# EAGLE design ProbeStationRelayBoard (EAGLE 9.6.2)
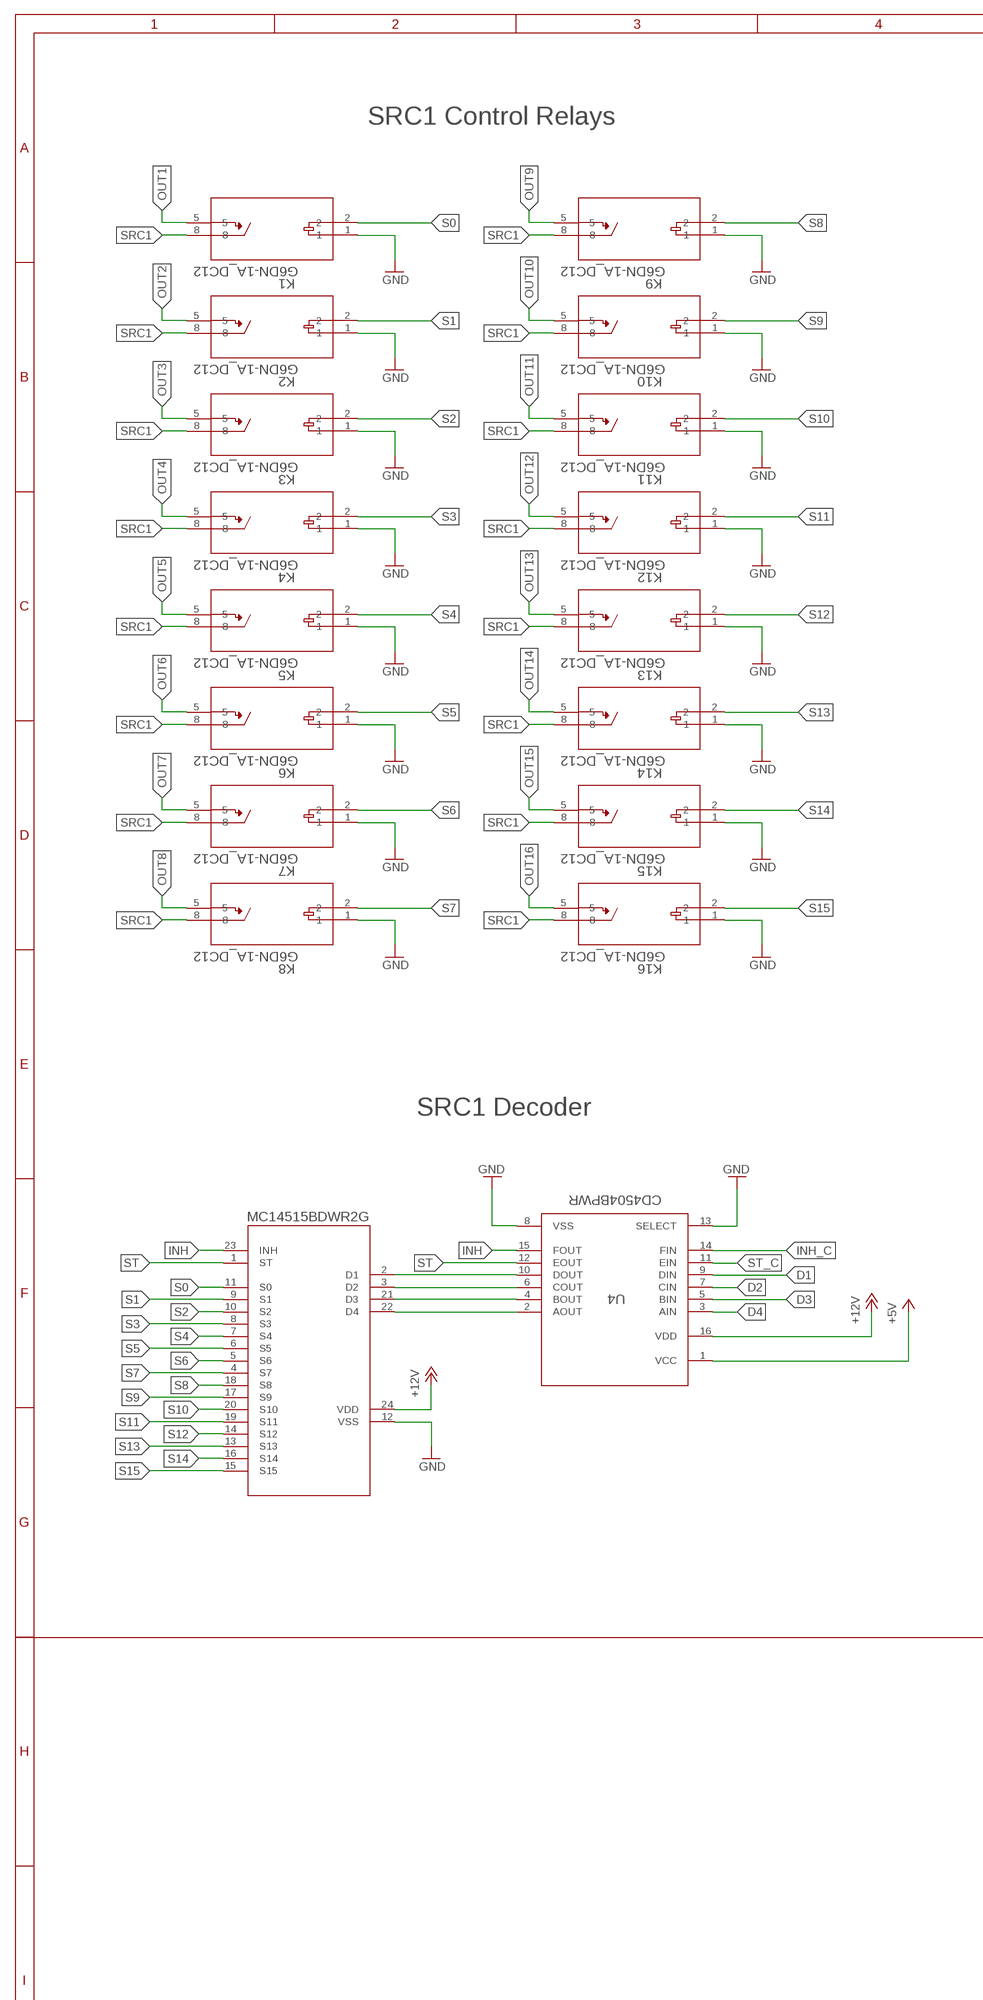
[diagram p0: schematic, sheet 1, part 1 of 2]
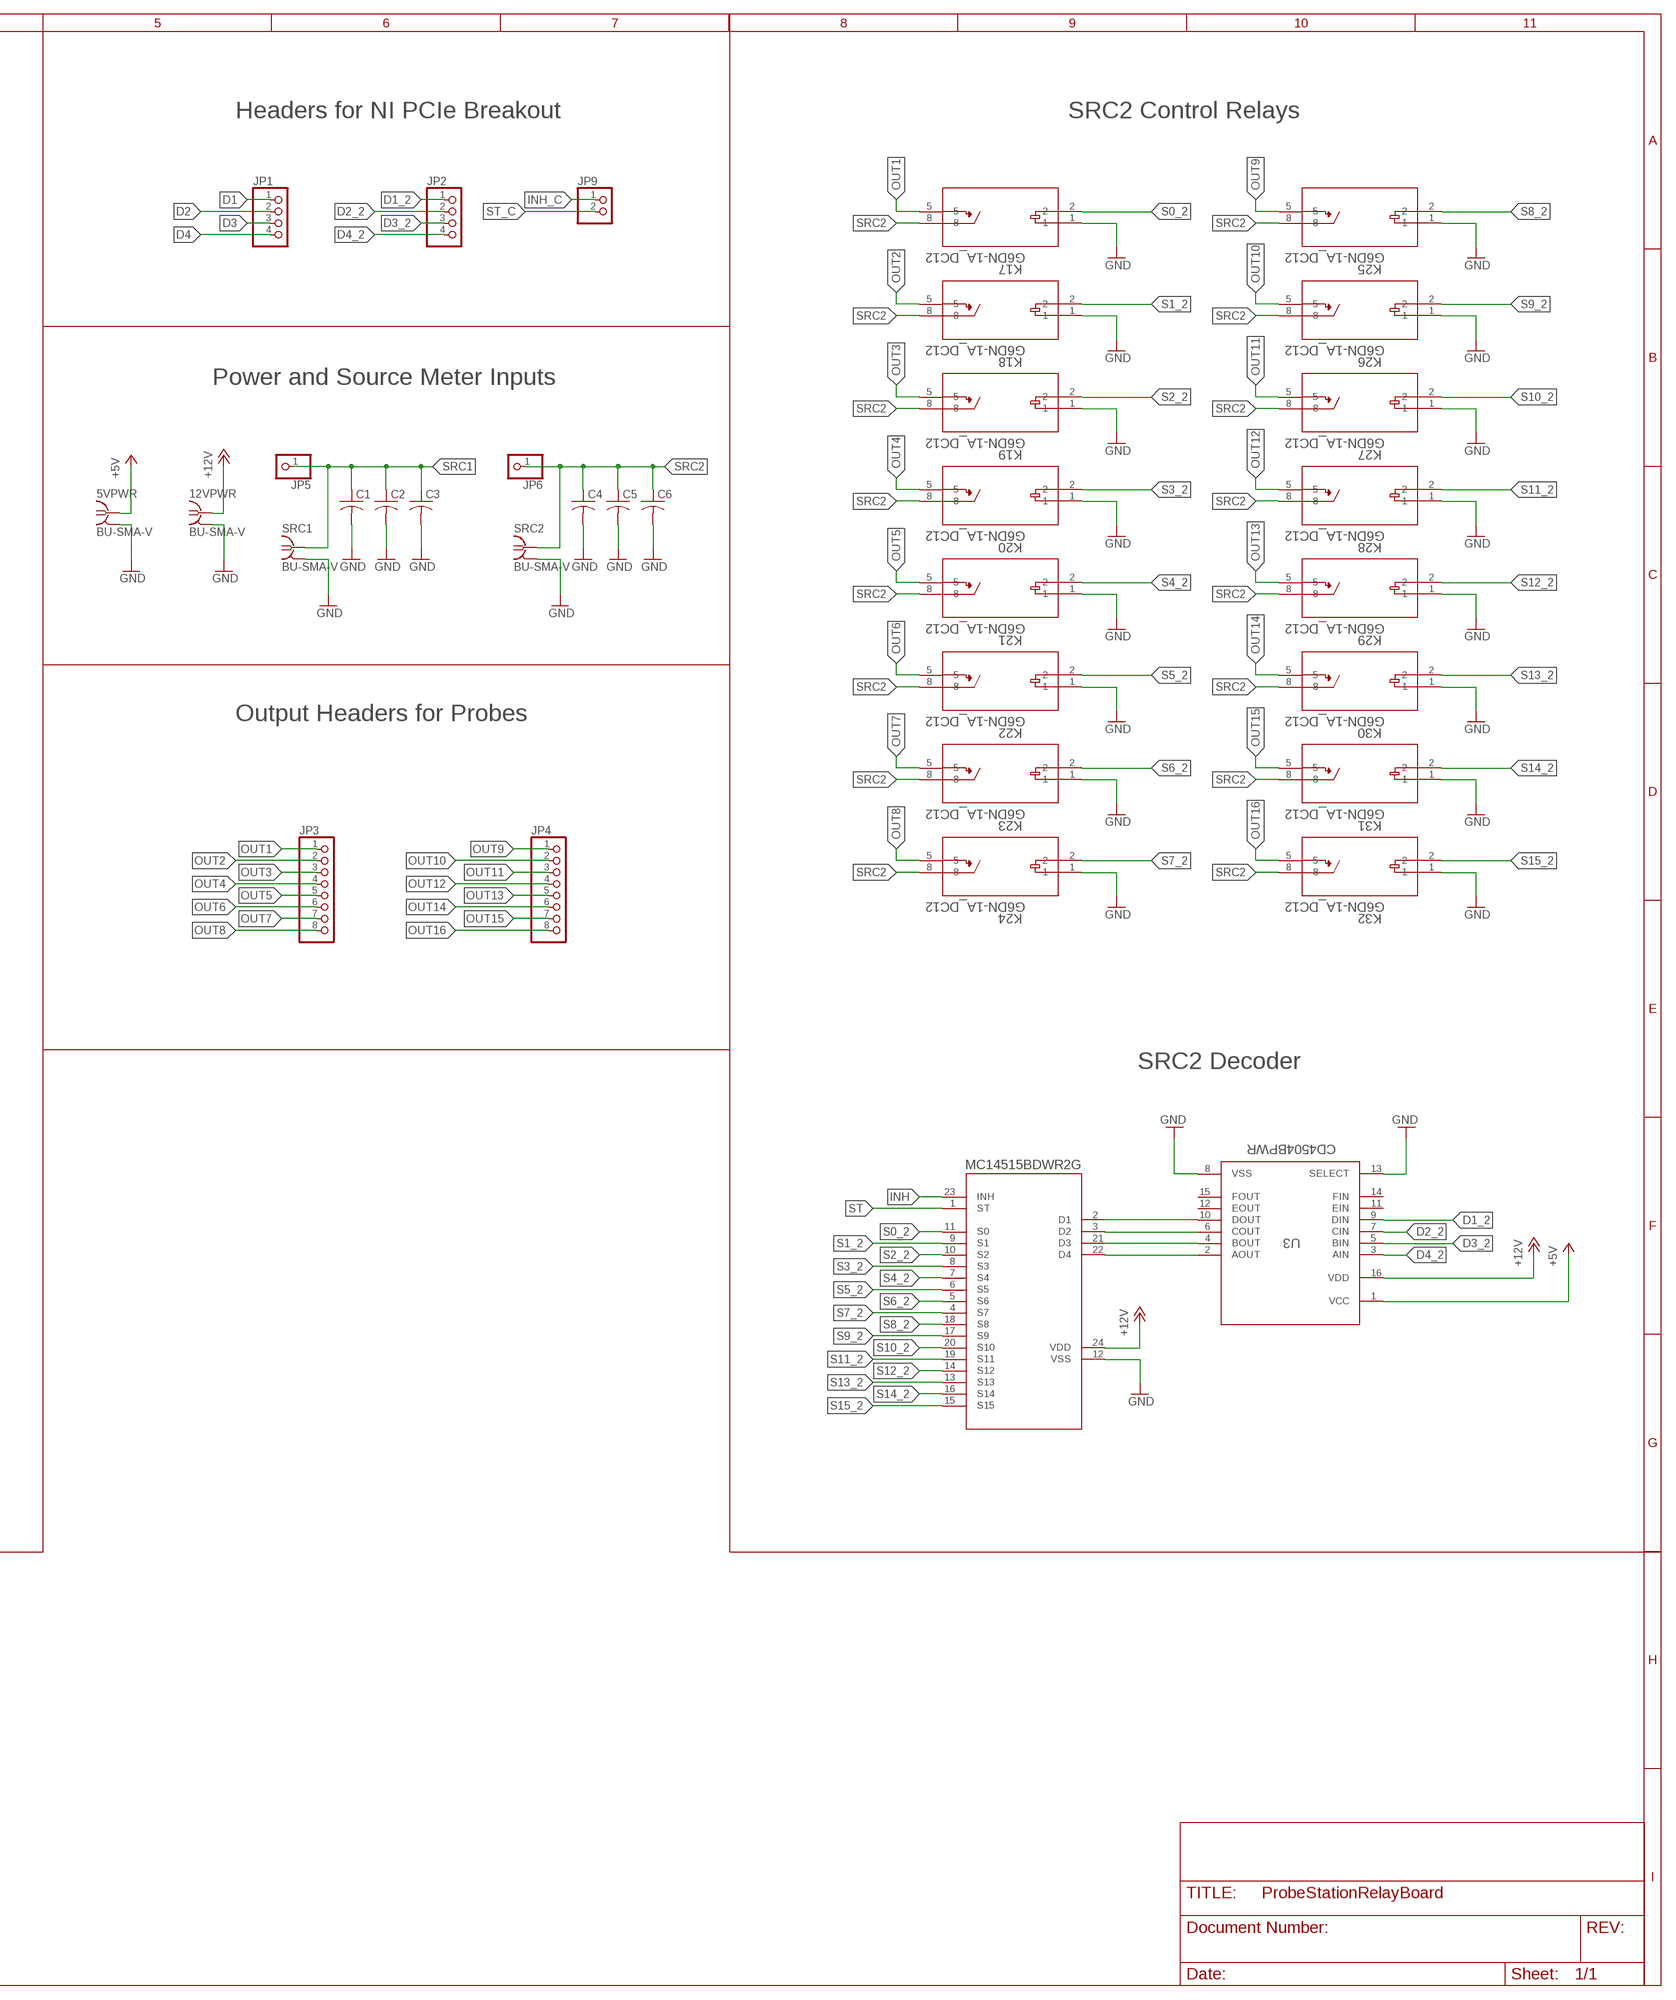
[diagram p1: schematic, sheet 1, part 2 of 2]

## Parts
5VPWR  BU-SMA-V  [BU-SMA-V]
12VPWR  BU-SMA-V  [BU-SMA-V]
C1  C-USC0805  [C0805]
C2  C-USC0805  [C0805]
C3  C-USC0805  [C0805]
C4  C-USC0805  [C0805]
C5  C-USC0805  [C0805]
C6  C-USC0805  [C0805]
JP1  PINHD-1X4  [1X04]
JP2  PINHD-1X4  [1X04]
JP3  PINHD-1X8  [1X08]
JP4  PINHD-1X8  [1X08]
JP5  PINHD-1X1  [1X01]
JP6  PINHD-1X1  [1X01]
JP9  PINHD-1X2  [1X02]
K1  G6DN-1A_DC12  [RELAY_G6DN-1A_OMR]
K2  G6DN-1A_DC12  [RELAY_G6DN-1A_OMR]
K3  G6DN-1A_DC12  [RELAY_G6DN-1A_OMR]
K4  G6DN-1A_DC12  [RELAY_G6DN-1A_OMR]
K5  G6DN-1A_DC12  [RELAY_G6DN-1A_OMR]
K6  G6DN-1A_DC12  [RELAY_G6DN-1A_OMR]
K7  G6DN-1A_DC12  [RELAY_G6DN-1A_OMR]
K8  G6DN-1A_DC12  [RELAY_G6DN-1A_OMR]
K9  G6DN-1A_DC12  [RELAY_G6DN-1A_OMR]
K10  G6DN-1A_DC12  [RELAY_G6DN-1A_OMR]
K11  G6DN-1A_DC12  [RELAY_G6DN-1A_OMR]
K12  G6DN-1A_DC12  [RELAY_G6DN-1A_OMR]
K13  G6DN-1A_DC12  [RELAY_G6DN-1A_OMR]
K14  G6DN-1A_DC12  [RELAY_G6DN-1A_OMR]
K15  G6DN-1A_DC12  [RELAY_G6DN-1A_OMR]
K16  G6DN-1A_DC12  [RELAY_G6DN-1A_OMR]
K17  G6DN-1A_DC12  [RELAY_G6DN-1A_OMR]
K18  G6DN-1A_DC12  [RELAY_G6DN-1A_OMR]
K19  G6DN-1A_DC12  [RELAY_G6DN-1A_OMR]
K20  G6DN-1A_DC12  [RELAY_G6DN-1A_OMR]
K21  G6DN-1A_DC12  [RELAY_G6DN-1A_OMR]
K22  G6DN-1A_DC12  [RELAY_G6DN-1A_OMR]
K23  G6DN-1A_DC12  [RELAY_G6DN-1A_OMR]
K24  G6DN-1A_DC12  [RELAY_G6DN-1A_OMR]
K25  G6DN-1A_DC12  [RELAY_G6DN-1A_OMR]
K26  G6DN-1A_DC12  [RELAY_G6DN-1A_OMR]
K27  G6DN-1A_DC12  [RELAY_G6DN-1A_OMR]
K28  G6DN-1A_DC12  [RELAY_G6DN-1A_OMR]
K29  G6DN-1A_DC12  [RELAY_G6DN-1A_OMR]
K30  G6DN-1A_DC12  [RELAY_G6DN-1A_OMR]
K31  G6DN-1A_DC12  [RELAY_G6DN-1A_OMR]
K32  G6DN-1A_DC12  [RELAY_G6DN-1A_OMR]
SRC1  BU-SMA-V  [BU-SMA-V]
SRC2  BU-SMA-V  [BU-SMA-V]
U1  MC14515BDWR2G  [SOIC-24WB_ONS]
U2  MC14515BDWR2G  [SOIC-24WB_ONS]
U3  CD4504BPWR  [PW0016A_N]
U4  CD4504BPWR  [PW0016A_N]

## Nets
+5V: 5VPWR.1 U3.1(VCC) U4.1(VCC)
+12V: 12VPWR.1 U1.24(VDD) U2.24(VDD) U3.16(VDD) U4.16(VDD)
D1: JP1.1 U4.9(DIN)
D1_2: JP2.1 U3.9(DIN)
D2: JP1.2 U4.7(CIN)
D2_2: JP2.2 U3.7(CIN)
D3: JP1.3 U4.5(BIN)
D3_2: JP2.3 U3.5(BIN)
D4: JP1.4 U4.3(AIN)
D4_2: JP2.4 U3.3(AIN)
GND: 5VPWR.2 5VPWR.3 5VPWR.4 5VPWR.5 12VPWR.2 12VPWR.3 12VPWR.4 12VPWR.5 C1.2 C2.2 C3.2 C4.2 C5.2 C6.2 K1.1 K2.1 K3.1 K4.1 K5.1 K6.1 K7.1 K8.1 K9.1 K10.1 K11.1 K12.1 K13.1 K14.1 K15.1 K16.1 K17.1 K18.1 K19.1 K20.1 K21.1 K22.1 K23.1 K24.1 K25.1 K26.1 K27.1 K28.1 K29.1 K30.1 K31.1 K32.1 SRC1.2 SRC1.3 SRC1.4 SRC1.5 SRC2.2 SRC2.3 SRC2.4 SRC2.5 U1.12(VSS) U2.12(VSS) U3.8(VSS) U3.13(SELECT) U4.8(VSS) U4.13(SELECT)
INH: U1.23(INH) U2.23(INH) U4.15(FOUT)
INH_C: JP9.1 U4.14(FIN)
N$1: U2.22(D4) U4.2(AOUT)
N$2: U2.21(D3) U4.4(BOUT)
N$3: U2.3(D2) U4.6(COUT)
N$4: U2.2(D1) U4.10(DOUT)
N$5: U1.22(D4) U3.2(AOUT)
N$6: U1.21(D3) U3.4(BOUT)
N$7: U1.3(D2) U3.6(COUT)
N$8: U1.2(D1) U3.10(DOUT)
OUT1: JP3.1 K1.5 K17.5
OUT2: JP3.2 K2.5 K18.5
OUT3: JP3.3 K3.5 K19.5
OUT4: JP3.4 K4.5 K20.5
OUT5: JP3.5 K5.5 K21.5
OUT6: JP3.6 K6.5 K22.5
OUT7: JP3.7 K7.5 K23.5
OUT8: JP3.8 K8.5 K24.5
OUT9: JP4.1 K9.5 K25.5
OUT10: JP4.2 K10.5 K26.5
OUT11: JP4.3 K11.5 K27.5
OUT12: JP4.4 K12.5 K28.5
OUT13: JP4.5 K13.5 K29.5
OUT14: JP4.6 K14.5 K30.5
OUT15: JP4.7 K15.5 K31.5
OUT16: JP4.8 K16.5 K32.5
S0: K1.2 U2.11(S0)
S0_2: K17.2 U1.11(S0)
S1: K2.2 U2.9(S1)
S1_2: K18.2 U1.9(S1)
S2: K3.2 U2.10(S2)
S2_2: K19.2 U1.10(S2)
S3: K4.2 U2.8(S3)
S3_2: K20.2 U1.8(S3)
S4: K5.2 U2.7(S4)
S4_2: K21.2 U1.7(S4)
S5: K6.2 U2.6(S5)
S5_2: K22.2 U1.6(S5)
S6: K7.2 U2.5(S6)
S6_2: K23.2 U1.5(S6)
S7: K8.2 U2.4(S7)
S7_2: K24.2 U1.4(S7)
S8: K9.2 U2.18(S8)
S8_2: K25.2 U1.18(S8)
S9: K10.2 U2.17(S9)
S9_2: K26.2 U1.17(S9)
S10: K11.2 U2.20(S10)
S10_2: K27.2 U1.20(S10)
S11: K12.2 U2.19(S11)
S11_2: K28.2 U1.19(S11)
S12: K13.2 U2.14(S12)
S12_2: K29.2 U1.14(S12)
S13: K14.2 U2.13(S13)
S13_2: K30.2 U1.13(S13)
S14: K15.2 U2.16(S14)
S14_2: K31.2 U1.16(S14)
S15: K16.2 U2.15(S15)
S15_2: K32.2 U1.15(S15)
SRC1: C1.1 C2.1 C3.1 JP5.1 K1.8 K2.8 K3.8 K4.8 K5.8 K6.8 K7.8 K8.8 K9.8 K10.8 K11.8 K12.8 K13.8 K14.8 K15.8 K16.8 SRC1.1
SRC2: C4.1 C5.1 C6.1 JP6.1 K17.8 K18.8 K19.8 K20.8 K21.8 K22.8 K23.8 K24.8 K25.8 K26.8 K27.8 K28.8 K29.8 K30.8 K31.8 K32.8 SRC2.1
ST: U1.1(ST) U2.1(ST) U4.12(EOUT)
ST_C: JP9.2 U4.11(EIN)
Unconnected: U3.11(EIN) U3.12(EOUT) U3.14(FIN) U3.15(FOUT)

## Notes on the sheet
- SRC1 Control Relays | Headers for NI PCIe Breakout | SRC2 Control Relays
- Power and Source Meter Inputs
- Output Headers for Probes
- SRC1 Decoder
- SRC2 Decoder

## Library data of the parts
5VPWR 12VPWR SRC1 SRC2 = con-coax:BU-SMA-V: FEMALE SMA CONNECTOR Radiall distributor RS 112-3794; OC_FARNELL: unknown; OC_NEWARK: unknown
C1-C6 = rcl:C-US: CAPACITOR, American symbol; SPICEPREFIX: C
JP1 JP2 = pinhead:PINHD-1X4: PIN HEADER
JP3 JP4 = pinhead:PINHD-1X8: PIN HEADER
JP5 JP6 = pinhead:PINHD-1X1: PIN HEADER
JP9 = pinhead:PINHD-1X2: PIN HEADER
K1-K32 = RELAY_G6DN_DC12:G6DN-1A_DC12; COPYRIGHT: Copyright (C) 2021 Ultra Librarian. All rights reserved.; DIGI-KEY_PART_NUMBER_1: Z5440-ND; MANUFACTURER_PART_NUMBER: G6DN-1A DC12; MFR_NAME: Omron
U1 U2 = MC14515BDWR2G:MC14515BDWR2G; COPYRIGHT: Copyright (C) 2021 Ultra Librarian. All rights reserved.; DIGI-KEY_PART_NUMBER_1: 2156-MC14515BDWR2G-OS-ND; DIGI-KEY_PART_NUMBER_2: MC14515BDWR2G-ND; DIGI-KEY_PART_NUMBER_3: MC14515BDWR2GOSCT-ND; DIGI-KEY_PART_NUMBER_4: MC14515BDWR2GOSDKR-ND; DIGI-KEY_PART_NUMBER_5: MC14515BDWR2GOSTR-ND; MANUFACTURER_PART_NUMBER: MC14515BDWR2G; MFR_NAME: ON Semiconductor
U3 U4 = CD4504BPWR:CD4504BPWR; COPYRIGHT: Copyright (C) 2021 Ultra Librarian. All rights reserved.; DIGI-KEY_PART_NUMBER_1: 296-12010-1-ND; DIGI-KEY_PART_NUMBER_2: 296-12010-2-ND; DIGI-KEY_PART_NUMBER_3: 296-12010-6-ND; MANUFACTURER_PART_NUMBER: CD4504BPWR; MFR_NAME: Texas Instruments; REFDES: RefDes; TYPE: TYPE

## Board
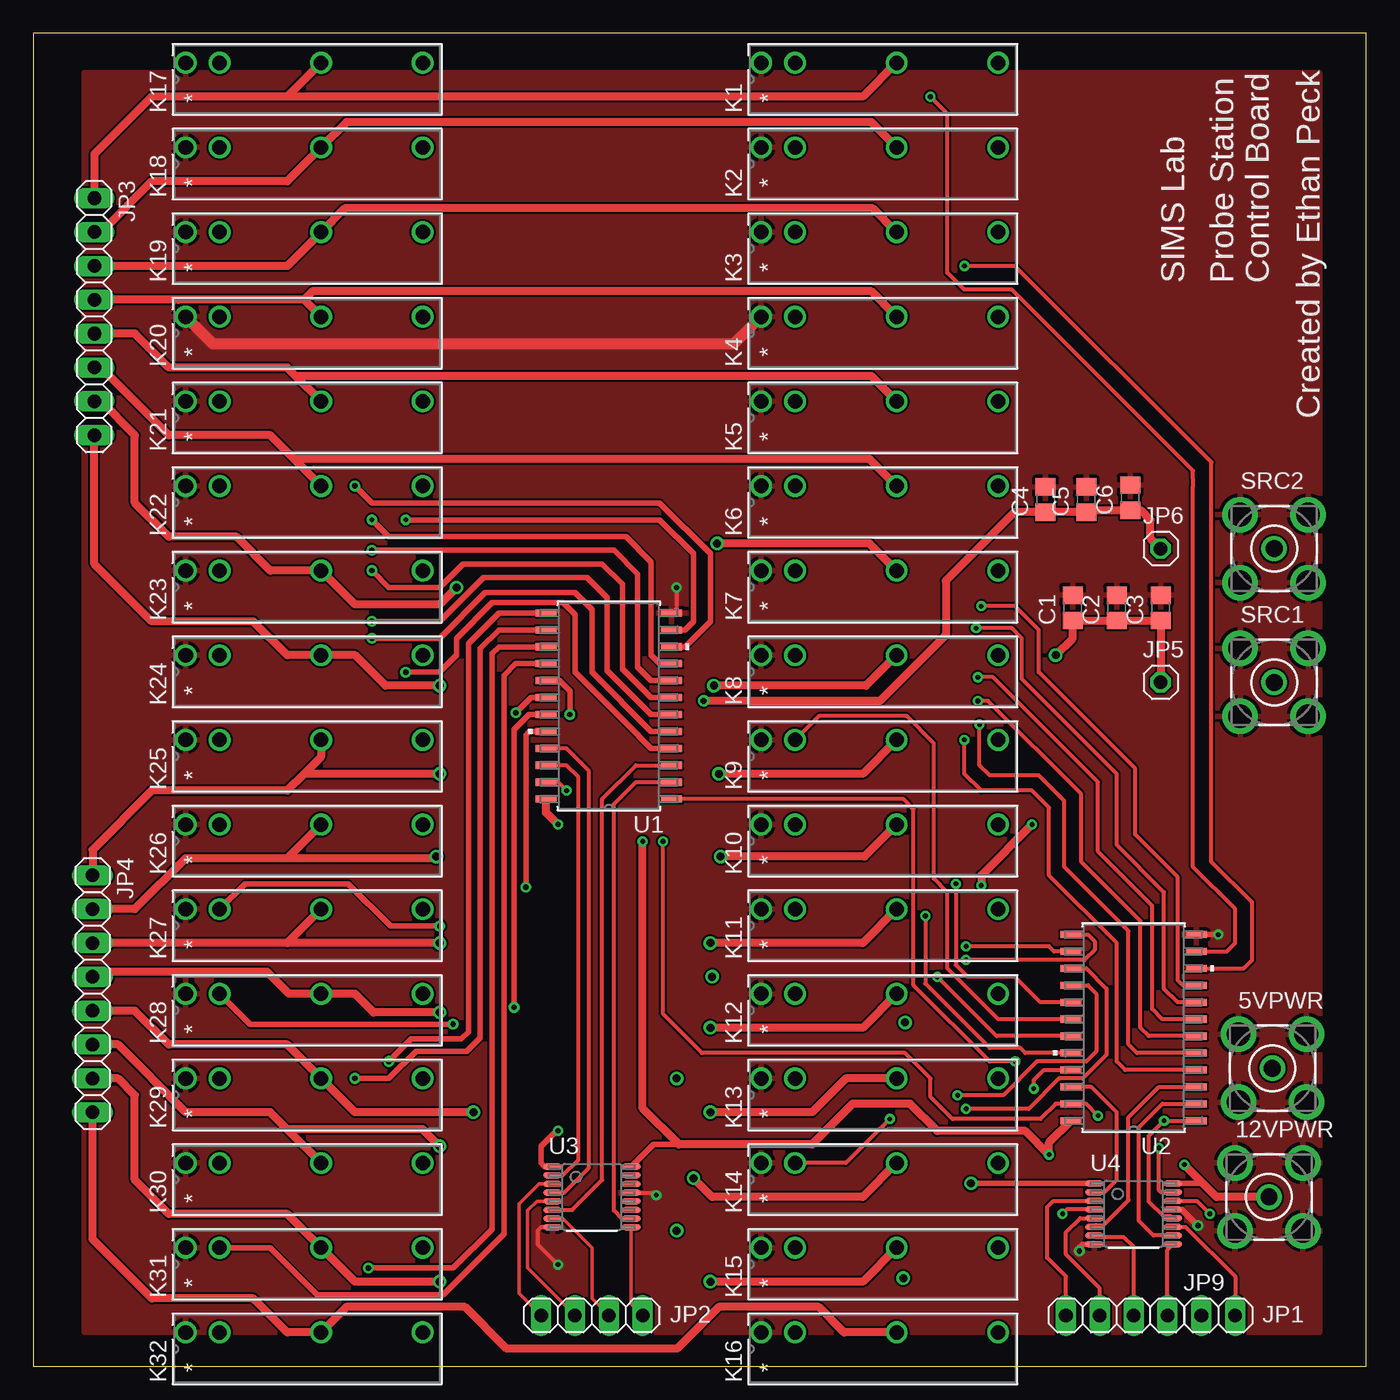
[diagram p2: board, top side]
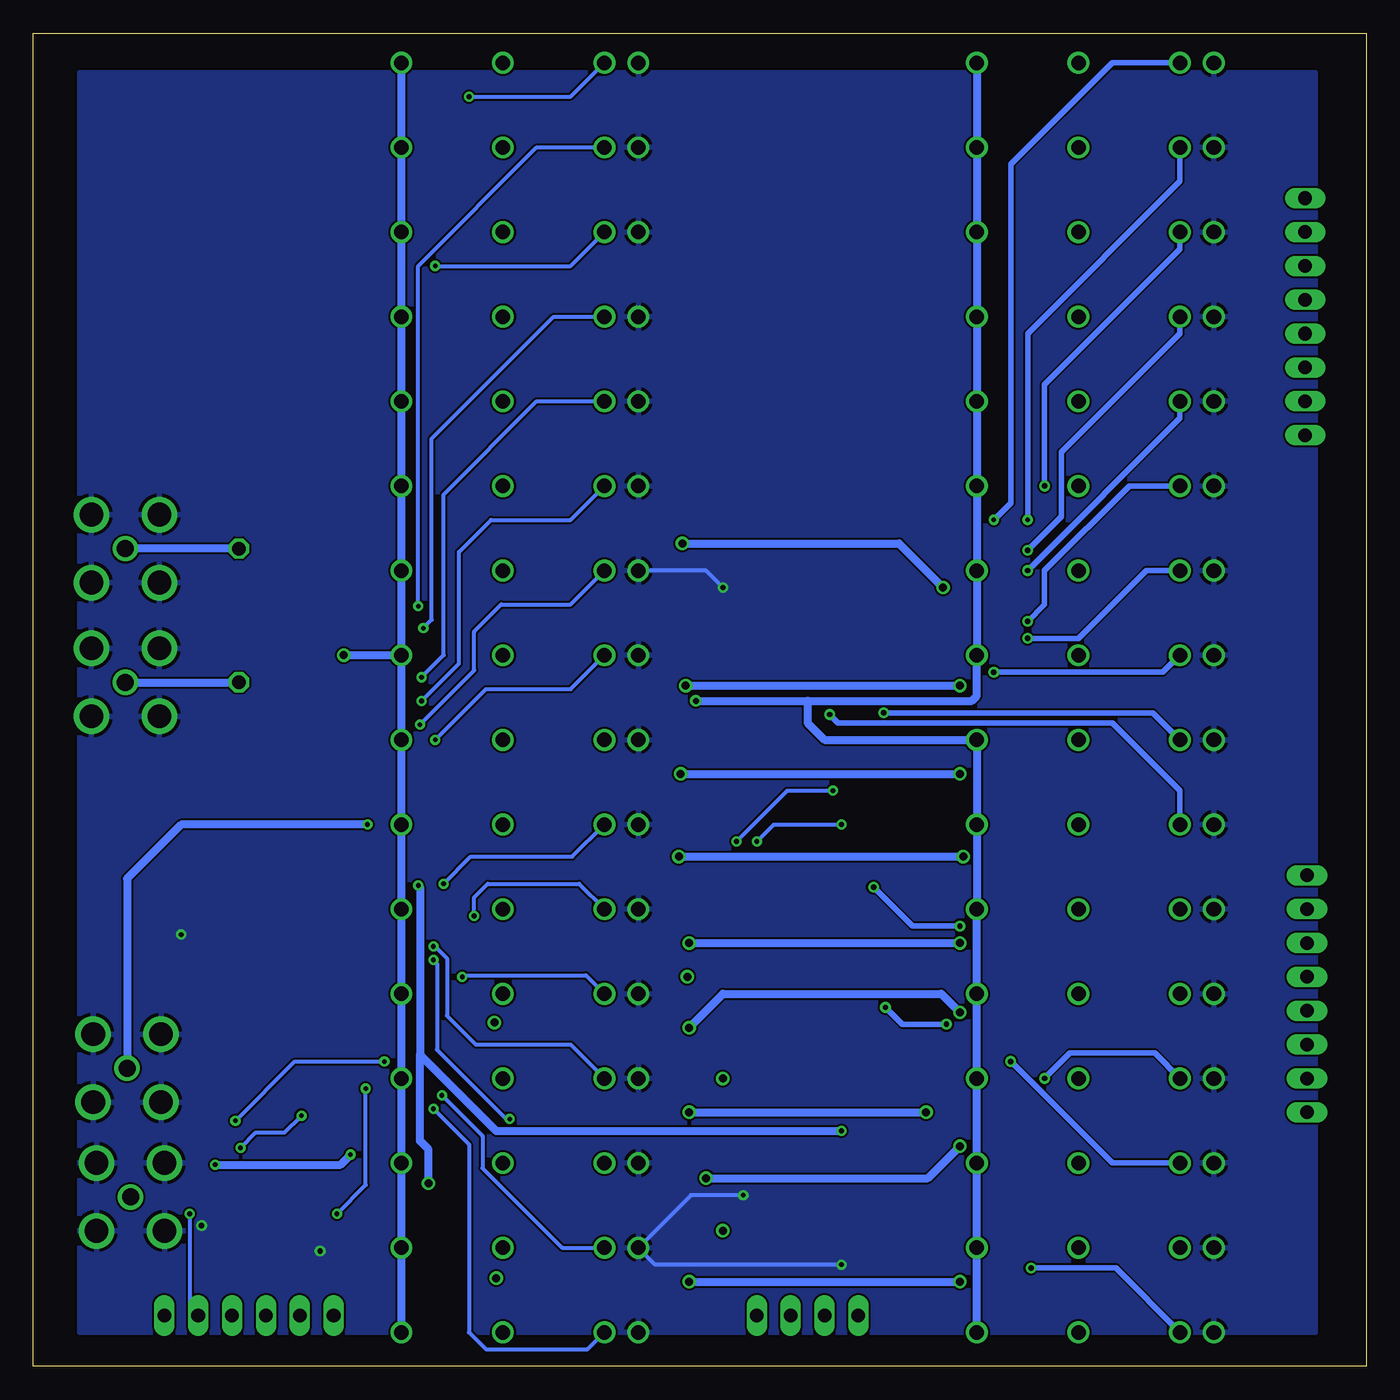
[diagram p3: board, bottom side, seen from below]

Size 100 x 100 mm. Coordinates in mm from the lower left corner, seen from the top.
Outline: 0,0 100,0 100,100 0,100 0,0
Copper layers (1*16): Top 0.035mm / dielectric 1.5mm / Bottom 0.035mm
Design rules "default": minimum track width 6mil, minimum drill 0.35mm, track to track 6mil, track to pad 6mil, pad to pad 6mil, via to via 6mil, smd to smd 6mil, copper to edge 40mil, drill to drill 6mil, minimum pad ring 10mil, minimum via ring 8mil, stop-mask expansion 4mil, vias tented up to drill 0mil, thermal gap 10mil

### Footprints (pad centres in the part's own frame; a part is rotated, then mirrored left to right if it is on the bottom)
BU-SMA-V = drill 1.27: 1 0,0 | drill 1.778: 2 -2.55,2.55; 3 2.55,2.55; 4 2.55,-2.55; 5 -2.55,-2.55
C0805 = smd 1.3 x 1.5: 1 -0.95,0; 2 0.95,0
1X04 = drill 1.016 long: 1 -3.81,0; 2 -1.27,0; 3 1.27,0; 4 3.81,0
1X08 = drill 1.016 long: 1 -8.89,0; 2 -6.35,0; 3 -3.81,0; 4 -1.27,0; 5 1.27,0; 6 3.81,0; 7 6.35,0; 8 8.89,0
1X01 = drill 1.016 octagon: 1 0,0
1X02 = drill 1.016 long: 1 -1.27,0; 2 1.27,0
RELAY_G6DN-1A_OMR = drill 1.092 pad 1.6: 1 0,0; 2 0,-2.54; 5 0,-10.16; 8 0,-17.78
SOIC-24WB_ONS = smd 1.589 x 0.533: 1 -4.712,6.985; 2 -4.712,5.715; 3 -4.712,4.445; 4 -4.712,3.175; 5 -4.712,1.905; 6 -4.712,0.635; 7 -4.712,-0.635; 8 -4.712,-1.905; 9 -4.712,-3.175; 10 -4.712,-4.445; 11 -4.712,-5.715; 12 -4.712,-6.985; 13 4.712,-6.985; 14 4.712,-5.715; 15 4.712,-4.445; 16 4.712,-3.175; 17 4.712,-1.905; 18 4.712,-0.635; 19 4.712,0.635; 20 4.712,1.905; 21 4.712,3.175; 22 4.712,4.445; 23 4.712,5.715; 24 4.712,6.985
PW0016A_N = smd 1.4 x 0.45: 1 -2.95,2.275; 2 -2.95,1.625; 3 -2.95,0.975; 4 -2.95,0.325; 5 -2.95,-0.325; 6 -2.95,-0.975; 7 -2.95,-1.625; 8 -2.95,-2.275; 9 2.95,-2.275; 10 2.95,-1.625; 11 2.95,-0.975; 12 2.95,-0.325; 13 2.95,0.325; 14 2.95,0.975; 15 2.95,1.625; 16 2.95,2.275

### Placement (x,y rotation side)
5VPWR  92.96,22.35 0 top
12VPWR  92.71,12.7 0 top
C1  77.98,56.9 90 top
C2  81.28,56.9 90 top
C3  84.58,56.9 90 top
C4  75.95,65.02 90 top
C5  78.99,65.02 90 top
C6  82.3,65.15 90 top
JP1  81.28,3.81 180 top
JP2  41.91,3.81 180 top
JP3  4.57,78.74 270 top
JP4  4.45,27.94 270 top
JP5  84.58,51.31 0 top
JP6  84.58,61.34 0 top
JP9  88.9,3.81 0 top
K1  54.61,97.79 90 top
K2  54.61,91.44 90 top
K3  54.61,85.09 90 top
K4  54.61,78.74 90 top
K5  54.61,72.39 90 top
K6  54.61,66.04 90 top
K7  54.61,59.69 90 top
K8  54.61,53.34 90 top
K9  54.61,46.99 90 top
K10  54.61,40.64 90 top
K11  54.61,34.29 90 top
K12  54.61,27.94 90 top
K13  54.61,21.59 90 top
K14  54.61,15.24 90 top
K15  54.61,8.89 90 top
K16  54.61,2.54 90 top
K17  11.43,97.79 90 top
K18  11.43,91.44 90 top
K19  11.43,85.09 90 top
K20  11.43,78.74 90 top
K21  11.43,72.39 90 top
K22  11.43,66.04 90 top
K23  11.43,59.69 90 top
K24  11.43,53.34 90 top
K25  11.43,46.99 90 top
K26  11.43,40.64 90 top
K27  11.43,34.29 90 top
K28  11.43,27.94 90 top
K29  11.43,21.59 90 top
K30  11.43,15.24 90 top
K31  11.43,8.89 90 top
K32  11.43,2.54 90 top
SRC1  93.09,51.31 0 top
SRC2  93.09,61.34 0 top
U1  43.18,49.53 180 top
U2  82.55,25.4 180 top
U3  41.91,12.7 0 top
U4  82.55,11.43 0 top

### Tracks (layer width: path | path; a pad name or v marks a point on that pad's centre or on a via)
+5V  (via drill 0.35, 0.6)
  Top 0.406: v70.36,13.72 79.59,13.72 U4.1 | U3.1 38.37,14.97 38.1,15.24 38.1,16.51 39.24,17.65 v39.37,17.65
  Top 0.61: v74.93,40.64 71.12,36.83 v71.12,36.07
  Bottom 0.61: 70.99,23.37 65.28,17.65 v39.37,17.65 | v71.12,36.07 70.99,35.94 70.99,23.37 | v70.36,13.72 70.36,16.26 70.99,16.89 70.99,23.37 | v74.93,40.64 88.9,40.64 92.96,36.58 5VPWR.1
+12V  (via drill 0.35)
  Top 0.305: U4.16
  Top 0.406: 87.76,13.72 U4.16 | U3.16 46.52,16.64 48.43,16.64
  Top 0.61: 12VPWR.1 88.77,12.7 87.76,13.72 v86.36,15.11 | U2.24 76.2,16.78 v76.2,15.88 74.42,17.65 67.82,17.65 65.79,19.68 61.47,19.68 58.42,16.64 48.43,16.64 45.72,19.34 v45.72,39.37 | v39.37,40.64 38.47,41.54 U1.24
  Bottom 0.305: v45.72,39.37 44.45,40.64 v39.37,40.64
  Bottom 0.61: v86.36,15.11 76.96,15.11 v76.2,15.88
D1
  Top 0.305: JP1.1 85.09,8.74 U4.9
D1_2
  Top 0.254: JP2.1 44.86,4.67 U3.9
D2
  Top 0.305: U4.7 79.72,9.69 81.82,9.69 82.55,8.95 JP1.2
D2_2
  Top 0.254: JP2.2 41.91,5.08 41.91,8.89 39.73,11.07 U3.7
D3
  Top 0.305: JP1.3 80.01,5.84 77.47,8.38 77.47,10.03 78.54,11.11 U4.5
D3_2
  Top 0.254: JP2.3 37.08,7.37 37.08,11.68 37.77,12.38 U3.5
D4
  Top 0.305: JP1.4 77.47,6.73 76.07,8.13 76.07,11.94 76.54,12.4 U4.3
D4_2
  Top 0.254: JP2.4 36.45,5.46 36.45,12.19 37.93,13.68 U3.3
GND  (via drill 0.35, 0.4)
  Top 0.305: v48.26,58.42 48.26,56.88 U1.12 | U3.8 38.11,10.43 37.85,10.16 37.85,9.14 v39.37,7.62 | U3.13 46.54,13.03 v46.74,12.83
  Top 0.406: U2.12 v88.9,32.38 | U4.13 86.15,11.76 87.36,10.54 v87.38,10.54 | U4.8 78.75,9.15 78.49,8.89 v78.49,8.64
  Top 0.813: K20.1 13.46,76.71 52.58,76.71 K4.1
  Bottom 0.305: v48.26,58.42 49.53,59.69 K7.1 | v39.37,7.62 53.34,7.62 K15.1 50.67,12.83 v46.74,12.83
  pour Top: 3.81,97.03 3.81,2.54 96.52,2.54 96.52,97.03
  pour Bottom: 3.81,96.52 3.81,97.03 96.52,97.03 96.52,2.54 3.81,2.54
INH  (via drill 0.35)
  Top 0.305: U4.15 84.61,13.05 84.45,13.21 v84.45,16.38 | v79.88,18.8 78.99,19.68 U2.23 76.71,19.68 75.56,18.54 68.96,18.54 67.31,20.19 67.31,21.59 65.41,23.5 50.16,23.5 47.24,26.42 v47.24,39.37 | v40.01,43.18 39.37,43.81 U1.23
  Bottom 0.305: v84.45,16.38 83.31,17.53 81.15,17.53 v79.88,18.8 | v47.24,39.37 43.43,43.18 v40.01,43.18
INH_C  (via drill 0.35)
  Top 0.305: U4.14 87.29,12.4 v88.27,11.43
  Bottom 0.305: v88.27,11.43 88.27,4.45 JP9.1
N$1
  Top 0.305: U4.2 80.36,13.05 81.28,13.97 81.28,19.05 79.38,20.95 U2.22
N$2  (via drill 0.35)
  Top 0.305: U4.4 77.54,11.76 v77.22,11.43 | v75.06,20.83 75.06,21.46 75.82,22.23 U2.21
  Bottom 0.305: v77.22,11.43 75.06,13.59 v75.06,20.83
N$3
  Top 0.305: U4.6 79.72,10.57 80.29,10.57 82.17,12.45 82.17,18.67 84.45,20.95 U2.3
N$4
  Top 0.305: U4.10 84.05,9.8 82.93,10.92 82.93,17.91 84.71,19.68 U2.2
N$5
  Top 0.305: U3.2 39.73,14.32 40.89,15.49 40.89,44.2 40.01,45.09 U1.22
N$6
  Top 0.305: U3.4 39.82,13.03 41.66,14.86 41.66,44.7 40.01,46.35 U1.21
N$7
  Top 0.305: U3.6 40.43,11.72 42.67,13.97 42.67,42.55 45.21,45.09 U1.3
N$8
  Top 0.305: U3.10 44.17,11.07 43.56,11.68 43.56,42.16 45.21,43.81 U1.2
N$9  (via drill 0.6)
  other vias: 48.26,21.59
N$10  (via drill 0.6)
  other vias: 48.26,10.16
N$11  (via drill 0.6)
  other vias: 65.41,25.78
N$12  (via drill 0.6)
  other vias: 50.93,29.21
N$13  (via drill 0.6)
  other vias: 65.28,6.6
OUT1
  Top 0.61: K17.5 19.05,95.25 | JP3.1 4.57,90.93 8.89,95.25 19.05,95.25 | K1.5 62.23,95.25 19.05,95.25
OUT2
  Top 0.61: JP3.2 5.08,85.09 8.89,88.9 19.05,88.9 K18.5 23.5,93.34 62.87,93.34 K2.5
OUT3
  Top 0.61: JP3.3 19.05,82.55 K19.5 23.37,86.87 62.99,86.87 K3.5
OUT4
  Top 0.61: JP3.4 10.89,80.01 10.9,80.02 20.31,80.02 | K20.5 20.31,80.02 | K4.5 62.87,80.64 20.94,80.64 20.31,80.02
OUT5
  Top 0.61: K21.5 19.68,74.3 | JP3.5 7.62,77.47 10.16,74.93 19.05,74.93 19.68,74.3 | K5.5 62.87,74.3 19.68,74.3
OUT6
  Top 0.61: K22.5 19.56,68.07 | 19.56,68.07 17.78,69.85 10.16,69.85 5.08,74.93 JP3.6 | K6.5 62.74,68.07 19.56,68.07
OUT7  (via drill 0.6)
  Top 0.61: JP3.7 5.08,72.39 7.62,69.85 7.62,64.77 10.16,62.23 15.24,62.23 17.78,59.69 K23.5 24.13,57.15 30.48,57.15 v31.75,58.42 | K7.5 62.74,61.72 v51.31,61.72
  Bottom 0.61: v51.31,61.72 35.05,61.72 v31.75,58.42
OUT8  (via drill 0.6)
  Top 0.61: JP3.8 4.57,60.2 8.89,55.88 16.51,55.88 19.05,53.34 K24.5 24.13,53.34 26.42,51.05 v30.48,51.05 | K8.5 62.48,51.05 v51.05,51.05
  Bottom 0.61: v51.05,51.05 v30.48,51.05
OUT9  (via drill 0.6)
  Top 0.61: K25.5 21.59,45.72 20.32,44.45 | JP4.1 4.45,38.73 8.89,43.18 19.05,43.18 20.32,44.45 | K9.5 62.23,44.45 v51.44,44.45 | v30.48,44.45 20.32,44.45
  Bottom 0.61: v51.44,44.45 v30.48,44.45
OUT10  (via drill 0.6)
  Top 0.61: K26.5 19.05,38.1 | JP4.2 7.62,34.29 11.43,38.1 19.05,38.1 | K10.5 62.36,38.23 v51.56,38.23 | v30.23,38.23 30.1,38.1 19.05,38.1
  Bottom 0.61: v51.56,38.23 v30.23,38.23
OUT11  (via drill 0.6)
  Top 0.61: K27.5 19.05,31.75 | 19.05,31.75 JP4.3 | K11.5 62.23,31.75 v50.8,31.75 | v30.48,31.75 19.05,31.75
  Bottom 0.61: v50.8,31.75 v30.48,31.75
OUT12  (via drill 0.6)
  Top 0.61: JP4.4 4.83,29.59 17.53,29.59 19.18,27.94 K28.5 24.13,27.94 25.53,26.54 v30.48,26.54 | K12.5 62.23,25.4 v50.8,25.4
  Bottom 0.61: v30.48,26.54 31.88,27.94 48.26,27.94 v50.8,25.4
OUT13  (via drill 0.6)
  Top 0.61: JP4.5 7.62,26.67 10.16,24.13 19.05,24.13 K29.5 24.13,19.05 v33.02,19.05 | K13.5 60.96,21.59 58.42,19.05 v50.8,19.05
  Bottom 0.61: v50.8,19.05 v33.02,19.05
OUT14  (via drill 0.6)
  Top 0.61: K30.5 19.05,17.78 | 19.05,17.78 17.78,19.05 11.43,19.05 6.35,24.13 JP4.6 | K14.5 62.23,12.7 50.93,12.7 v49.53,14.1 | 19.05,17.78 29.21,17.78 v30.48,16.51
  Bottom 0.61: v49.53,14.1 32.89,14.1 v30.48,16.51
OUT15  (via drill 0.6)
  Top 0.61: JP4.7 6.35,21.59 7.62,20.32 7.62,13.97 10.16,11.43 19.05,11.43 K31.5 24.13,6.35 v30.48,6.35 | K15.5 62.23,6.35 v50.8,6.35
  Bottom 0.61: v50.8,6.35 v30.48,6.35
OUT16
  Top 0.61: JP4.8 4.45,9.53 8.89,5.08 16.51,5.08 19.05,2.54 K32.5 23.5,4.45 32.38,4.45 35.51,1.32 48.31,1.32 51.44,4.45 58.93,4.45 60.83,2.54 K16.5
S0  (via drill 0.35)
  Top 0.305: U2.11 89.53,31.11 90.17,31.75 90.17,34.29 87,37.47 87,66.04 87,66.55 87,67.18 73.41,80.77 69.85,80.77 68.58,82.04 68.58,93.98 v67.31,95.25
  Bottom 0.305: v67.31,95.25 59.69,95.25 K1.2
S0_2  (via drill 0.35)
  Top 0.406: U1.11 48.9,55.24 49.53,55.88 49.53,60.96 46.99,63.5 v27.94,63.5
  Bottom 0.406: v27.94,63.5 26.67,64.77 26.67,90.17 19.05,97.79 K17.2
S1  (via drill 0.35)
  Top 0.305: U2.9 86.23,28.57 85.85,28.96 85.85,36.7 82.68,39.88 82.68,44.83 75.44,52.07 75.44,55.24 73.66,57.02 v71.12,57.02
  Bottom 0.305: v71.12,57.02 71.12,82.55 62.23,91.44 K2.2
S1_2  (via drill 0.35)
  Top 0.406: v25.4,63.5 26.67,62.23 44.45,62.23 46.35,60.33 46.35,53.34 46.99,52.7 U1.9
  Bottom 0.406: K18.2 13.97,88.9 25.4,77.47 v25.4,63.5
S2  (via drill 0.35)
  Top 0.305: U2.10 90.81,29.84 91.44,30.48 91.44,34.8 88.39,37.85 88.39,67.82 73.66,82.55 v69.85,82.55
  Bottom 0.305: v69.85,82.55 59.69,82.55 K3.2
S2_2  (via drill 0.4)
  Top 0.406: U1.10 48.9,53.98 50.8,55.88 50.8,60.96 46.99,64.77 25.4,64.77 v24.13,66.04
  Bottom 0.406: v24.13,66.04 24.13,73.66 13.97,83.82 K19.2
S3  (via drill 0.35)
  Top 0.305: U2.8 85.85,27.3 84.84,28.32 84.84,35.56 81.28,39.12 81.28,44.45 74.17,51.56 74.17,54.61 73.41,55.37 v70.74,55.37
  Bottom 0.305: v70.74,55.37 70.1,56.01 70.1,69.6 60.96,78.74 K4.2
S3_2  (via drill 0.4)
  Top 0.406: U1.8 46.35,51.44 45.34,52.45 45.34,59.44 43.56,61.21 v25.4,61.21
  Bottom 0.406: v25.4,61.21 22.86,63.75 22.86,68.58 13.97,77.47 K20.2
S4  (via drill 0.35)
  Top 0.305: U2.7 84.71,26.04 83.95,26.8 83.95,34.54 79.88,38.61 79.88,43.81 72.01,51.69 v70.87,51.69
  Bottom 0.305: v70.87,51.69 69.22,53.34 69.22,65.41 62.23,72.39 K5.2
S4_2  (via drill 0.4)
  Top 0.406: U1.7 46.35,50.16 44.2,52.32 44.2,58.67 42.67,60.2 32.26,60.2 30.48,58.42 26.67,58.42 v25.4,59.69
  Bottom 0.406: v25.4,59.69 13.97,71.12 K21.2
S5  (via drill 0.35)
  Top 0.305: U2.6 83.69,24.77 83.06,25.4 83.06,33.4 78.61,37.85 78.61,42.93 71.63,49.91 v70.87,49.91
  Bottom 0.305: v70.87,49.91 68.07,52.7 68.07,61.09 65.66,63.5 59.69,63.5 K6.2
S5_2  (via drill 0.4)
  Top 0.406: U1.6 46.35,48.9 43.05,52.2 43.05,57.66 41.53,59.18 33.78,59.18 30.48,55.88 v25.4,55.88
  Bottom 0.406: v25.4,55.88 24.13,57.15 24.13,59.69 17.78,66.04 K22.2
S6  (via drill 0.35)
  Top 0.305: U2.5 82.8,23.5 82.17,24.13 82.17,32.64 77.34,37.47 77.34,42.42 75.44,44.32 71.75,44.32 70.99,45.09 v70.99,48.13
  Bottom 0.305: v70.99,48.13 66.93,52.2 66.93,55.12 64.9,57.15 59.69,57.15 K7.2
S6_2  (via drill 0.4)
  Top 0.406: U1.5 46.35,47.62 41.91,52.07 41.91,56.77 40.64,58.04 33.91,58.04 30.48,54.61 v25.4,54.61
  Bottom 0.406: v25.4,54.61 21.59,54.61 16.51,59.69 K23.2
S7  (via drill 0.35)
  Top 0.305: U2.4 81.92,22.23 81.28,22.86 81.28,31.75 76.2,36.83 76.2,41.91 74.93,43.18 71.12,43.18 69.85,44.45 v69.85,46.99
  Bottom 0.305: v69.85,46.99 66.04,50.8 59.69,50.8 K8.2
S7_2  (via drill 0.4)
  Top 0.406: U1.4 46.35,46.35 44.45,48.26 | 44.45,48.26 40.64,52.07 40.64,56.39 39.75,57.28 34.42,57.28 31.75,54.61 31.75,53.34 30.48,52.07 v27.94,52.07 | 44.45,48.26
  Bottom 0.406: v27.94,52.07 15.24,52.07 K24.2
S8
  Top 0.305: U2.18 72.39,26.04 68.58,29.84 68.58,35.56 67.56,36.58 67.56,41.91 67.56,42.42 67.56,46.74 65.53,48.77 58.93,48.77 K9.2
S8_2  (via drill 0.4)
  Top 0.406: U1.18 37.34,50.16 v36.2,49.02
  Bottom 0.406: K25.2 16,49.02 v36.2,49.02
S9  (via drill 0.35)
  Top 0.305: U2.17 75.56,27.3 73.66,29.21 70.1,29.21 69.22,30.1 v69.22,36.2
  Bottom 0.305: v69.22,36.2 67.18,38.23 59.56,38.23 K10.2
S9_2  (via drill 0.4)
  Top 0.406: U1.17 39.5,51.44 40.26,50.67 v40.26,48.9
  Bottom 0.406: v40.26,48.9 39.62,48.26 19.05,48.26 13.97,43.18 K26.2
S10  (via drill 0.35)
  Top 0.305: U2.20 74.42,23.5 74.04,23.88 71.75,23.88 66.93,28.7 v66.93,33.78
  Bottom 0.305: v66.93,33.78 66.93,35.18 65.91,36.2 59.05,36.2 K11.2
S10_2  (via drill 0.4)
  Top 0.406: U1.20 37.21,47.62 36.96,47.37 v36.96,35.94 | v30.48,33.02 26.8,33.02 23.62,36.2 15.88,36.2 K27.2
  Bottom 0.406: v36.96,35.94 34.04,33.02 v30.48,33.02
S11  (via drill 0.35)
  Top 0.305: U2.19 72.26,24.77 v67.82,29.21
  Bottom 0.305: v67.82,29.21 67.69,29.34 58.55,29.34 K12.2
S11_2  (via drill 0.4)
  Top 0.406: U1.19 37.21,48.9 36.07,47.75 v36.07,26.92 | v31.5,25.65 16.26,25.65 K28.2
  Bottom 0.406: v36.07,26.92 34.8,25.65 v31.5,25.65
S12  (via drill 0.35)
  Top 0.305: U2.14 76.58,31.11 76.2,31.5 v69.98,31.5
  Bottom 0.305: v69.98,31.5 69.85,31.5 68.96,30.61 68.96,26.29 66.8,24.13 59.69,24.13 K13.2
S12_2  (via drill 0.4)
  Top 0.406: U1.14 34.92,55.24 33.53,53.85 33.53,24.64 32.51,23.62 28.7,23.62 26.67,21.59 v24.13,21.59
  Bottom 0.406: K29.2 15.88,23.5 22.23,23.5 v24.13,21.59
S13  (via drill 0.35)
  Top 0.305: U2.13 79.12,32.38 79.63,31.88 79.63,31.24 78.87,30.48 v69.98,30.48 | v64.26,18.54 60.96,15.24 K14.2
  Bottom 0.305: v69.98,30.48 69.72,30.23 69.72,23.75 64.52,18.54 v64.26,18.54
S13_2  (via drill 0.4)
  Top 0.406: U1.13 34.92,56.52 32.64,54.23 32.64,25.07 32.11,24.54 28.35,24.54 v26.67,22.86
  Bottom 0.406: v26.67,22.86 19.05,15.24 K30.2
S14  (via drill 0.35)
  Top 0.305: U2.16 79.12,28.57 79.76,27.94 79.76,23.62 78.99,22.86 75.31,22.86 72.77,20.32 v69.34,20.32
  Bottom 0.305: v69.34,20.32 66.29,17.27 66.29,14.86 60.33,8.89 K15.2
S14_2
  Top 0.406: U1.16 36.2,52.7 35.31,51.82 35.31,9.93 30.73,5.36 21.31,5.36 17.78,8.89 K31.2
S15  (via drill 0.35)
  Top 0.305: U2.15 78.99,29.84 80.52,28.32 80.52,23.37 78.74,21.59 76.96,21.59 74.68,19.3 v69.98,19.3
  Bottom 0.305: v69.98,19.3 67.31,16.64 67.31,2.54 66.04,1.27 58.42,1.27 K16.2
S15_2  (via drill 0.4)
  Top 0.406: U1.15 34.92,53.98 34.42,53.47 34.42,10.29 31.5,7.37 v25.15,7.37
  Bottom 0.406: v25.15,7.37 18.8,7.37 K32.2
SRC1  (via drill 0.6)
  Top 0.61: v76.71,53.34 77.98,54.61 C1.1 C2.1 C3.1 JP5.1
  Bottom 0.61: K1.8 K2.8 K3.8 K4.8 K5.8 K6.8 K7.8 K8.8 | K8.8 K9.8 K10.8 K11.8 K12.8 K13.8 K14.8 K15.8 K16.8 | SRC1.1 JP5.1 | v76.71,53.34 K8.8
SRC2  (via drill 0.45)
  Top 0.61: v50.29,49.91 63.5,49.91 68.45,54.86 68.45,58.93 73.6,64.07 C4.1 C5.1 79.12,64.2 C6.1 83.12,64.2 83.82,63.5 83.82,62.1 JP6.1
  Bottom 0.61: K17.8 K18.8 K19.8 K20.8 K21.8 K22.8 K23.8 K24.8 29.21,50.29 29.59,49.91 41.91,49.91 | K32.8 K31.8 K30.8 K29.8 K28.8 K27.8 K26.8 K25.8 40.64,46.99 41.91,48.26 41.91,49.91 | v50.29,49.91 41.91,49.91 | JP6.1 SRC2.1
ST  (via drill 0.35)
  Top 0.305: U4.12 85.38,11.22 84.81,11.22 83.69,12.34 83.69,17.27 v84.84,18.41 U2.1 | v73.66,22.86 71.75,22.86 66.04,28.57 66.04,41.78 65.28,42.55 U1.1
  Bottom 0.305: v84.84,18.41 80.39,22.86 v73.66,22.86
ST_C
  Top 0.305: U4.11 86.45,10.46 90.17,6.73 JP9.2

### Text on the board
tNames: SIMS Lab | Probe Station / Control Board | Created by Ethan Peck